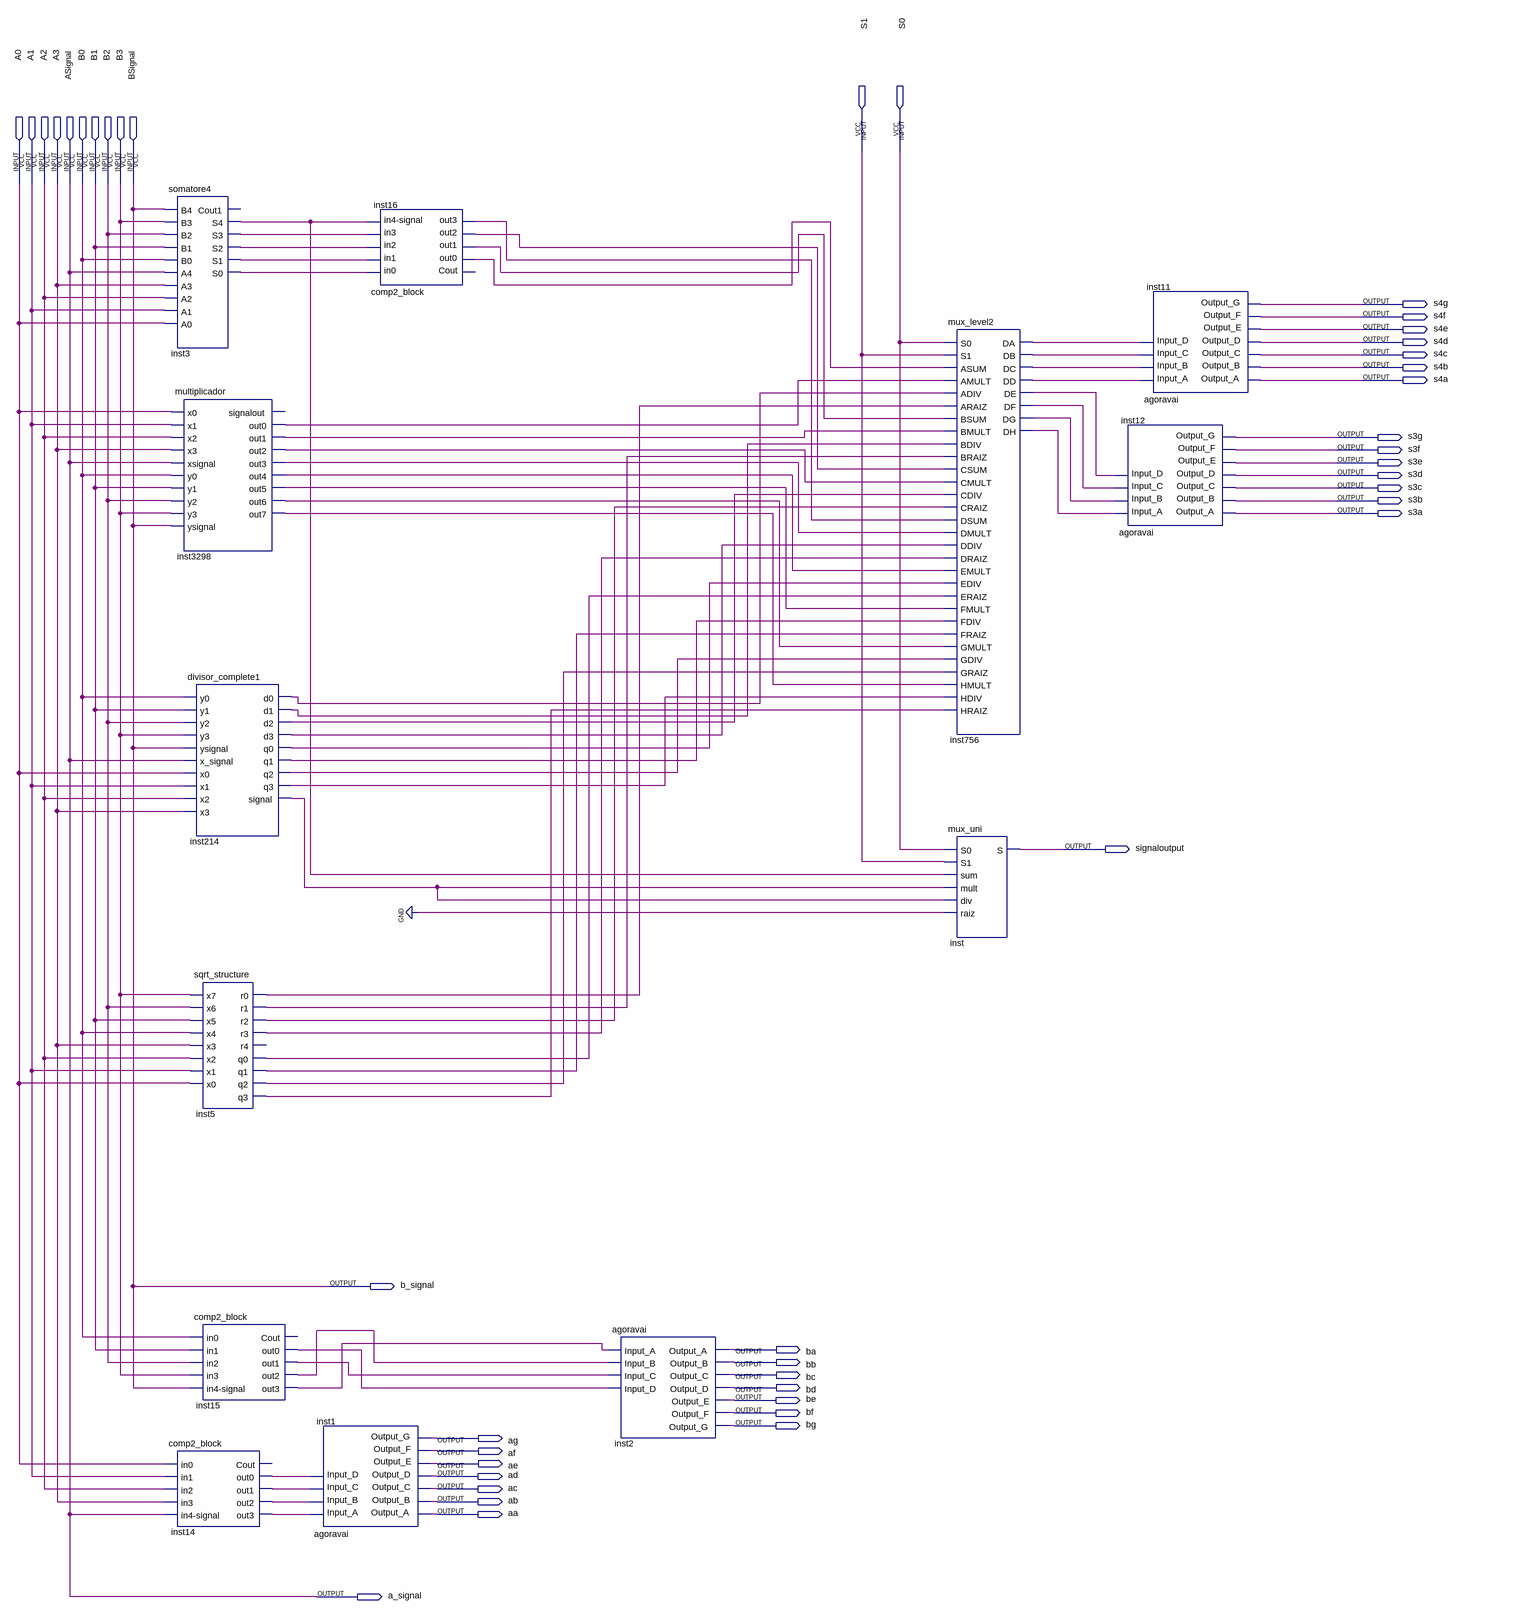
[diagram p0: schematic sheet]
// Quartus schematic end_project(2).bdf as structural Verilog: 13 symbols, 43 pins
module \end_project(2)  (
  input  S1,
  input  S0,
  input  A0,
  input  A1,
  input  A2,
  input  A3,
  input  ASignal,
  input  B0,
  input  B1,
  input  B2,
  input  B3,
  input  BSignal,
  output s4g,
  output s4f,
  output s4e,
  output s4d,
  output s4c,
  output s4b,
  output s4a,
  output s3g,
  output s3f,
  output s3e,
  output s3d,
  output s3c,
  output s3b,
  output s3a,
  output signaloutput,
  output b_signal,
  output ba,
  output bb,
  output bc,
  output bd,
  output be,
  output bf,
  output bg,
  output ag,
  output af,
  output ae,
  output ad,
  output ac,
  output ab,
  output aa,
  output a_signal
);

  wire inst3_s0, inst3_s1, inst3_s2, inst3_s3, inst3_s4, inst5_q0, inst5_q1, inst5_q2, inst5_q3, inst5_r0,
       inst5_r1, inst5_r2, inst5_r3, inst14_out0, inst14_out1, inst14_out2, inst14_out3, inst15_out0,
       inst15_out1, inst15_out2, inst15_out3, inst16_out0, inst16_out1, inst16_out2, inst16_out3, inst214_d0,
       inst214_d1, inst214_d2, inst214_d3, inst214_q0, inst214_q1, inst214_q2, inst214_q3, inst214_signal,
       inst756_da, inst756_db, inst756_dc, inst756_dd, inst756_de, inst756_df, inst756_dg, inst756_dh,
       inst3298_out0, inst3298_out1, inst3298_out2, inst3298_out3, inst3298_out4, inst3298_out5,
       inst3298_out6, inst3298_out7;

  somatore4 inst3 (
    .B4(BSignal), .B3(B3), .B2(B2), .B1(B1), .B0(B0), .A4(ASignal), .A3(A3), .A2(A2), .A1(A1), .A0(A0),
    .S4(inst3_s4), .S3(inst3_s3), .S2(inst3_s2), .S1(inst3_s1), .S0(inst3_s0));  // open: Cout1
  multiplicador inst3298 (
    .x0(A0), .x1(A1), .x2(A2), .x3(A3), .xsignal(ASignal), .y0(B0), .y1(B1), .y2(B2), .y3(B3),
    .ysignal(BSignal), .out0(inst3298_out0), .out1(inst3298_out1), .out2(inst3298_out2),
    .out3(inst3298_out3), .out4(inst3298_out4), .out5(inst3298_out5), .out6(inst3298_out6),
    .out7(inst3298_out7));  // open: signalout
  divisor_complete1 inst214 (
    .y0(B0), .y1(B1), .y2(B2), .y3(B3), .ysignal(BSignal), .x_signal(ASignal), .x0(A0), .x1(A1), .x2(A2),
    .x3(A3), .d0(inst214_d0), .d1(inst214_d1), .d2(inst214_d2), .d3(inst214_d3), .q0(inst214_q0),
    .q1(inst214_q1), .q2(inst214_q2), .q3(inst214_q3), .signal(inst214_signal));
  sqrt_structure inst5 (
    .x7(B3), .x6(B2), .x5(B1), .x4(B0), .x3(A3), .x2(A2), .x1(A1), .x0(A0), .r0(inst5_r0), .r1(inst5_r1),
    .r2(inst5_r2), .r3(inst5_r3), .q0(inst5_q0), .q1(inst5_q1), .q2(inst5_q2), .q3(inst5_q3));  // open: r4
  comp2_block inst15 (
    .in0(B0), .in1(B1), .in2(B2), .in3(B3), .\in4-signal (BSignal), .out0(inst15_out0), .out1(inst15_out1),
    .out2(inst15_out2), .out3(inst15_out3));  // open: Cout
  comp2_block inst14 (
    .in0(A0), .in1(A1), .in2(A2), .in3(A3), .\in4-signal (ASignal), .out0(inst14_out0), .out1(inst14_out1),
    .out2(inst14_out2), .out3(inst14_out3));  // open: Cout
  agoravai inst1 (
    .Input_A(inst14_out3), .Input_B(inst14_out2), .Input_C(inst14_out1), .Input_D(inst14_out0),
    .Output_A(aa), .Output_B(ab), .Output_C(ac), .Output_D(ad), .Output_E(ae), .Output_F(af), .Output_G(ag));
  comp2_block inst16 (
    .in0(inst3_s0), .in1(inst3_s1), .in2(inst3_s2), .in3(inst3_s3), .\in4-signal (inst3_s4),
    .out0(inst16_out0), .out1(inst16_out1), .out2(inst16_out2), .out3(inst16_out3));  // open: Cout
  agoravai inst2 (
    .Input_A(inst15_out3), .Input_B(inst15_out2), .Input_C(inst15_out1), .Input_D(inst15_out0),
    .Output_A(ba), .Output_B(bb), .Output_C(bc), .Output_D(bd), .Output_E(be), .Output_F(bf), .Output_G(bg));
  mux_level2 inst756 (
    .S0(S0), .S1(S1), .ASUM(inst16_out0), .AMULT(inst3298_out0), .ADIV(inst214_d0), .ARAIZ(inst5_r0),
    .BSUM(inst16_out1), .BMULT(inst3298_out1), .BDIV(inst214_d1), .BRAIZ(inst5_r1), .CSUM(inst16_out2),
    .CMULT(inst3298_out2), .CDIV(inst214_d2), .CRAIZ(inst5_r2), .DSUM(inst16_out3), .DMULT(inst3298_out3),
    .DDIV(inst214_d3), .DRAIZ(inst5_r3), .EMULT(inst3298_out4), .EDIV(inst214_q0), .ERAIZ(inst5_q0),
    .FMULT(inst3298_out5), .FDIV(inst214_q1), .FRAIZ(inst5_q1), .GMULT(inst3298_out6), .GDIV(inst214_q2),
    .GRAIZ(inst5_q2), .HMULT(inst3298_out7), .HDIV(inst214_q3), .HRAIZ(inst5_q3), .DA(inst756_da),
    .DB(inst756_db), .DC(inst756_dc), .DD(inst756_dd), .DE(inst756_de), .DF(inst756_df), .DG(inst756_dg),
    .DH(inst756_dh));
  mux_uni inst (
    .S0(S0), .S1(S1), .sum(inst3_s4), .mult(inst214_signal), .div(inst214_signal), .raiz(1'b0),
    .S(signaloutput));
  agoravai inst12 (
    .Input_A(inst756_dh), .Input_B(inst756_dg), .Input_C(inst756_df), .Input_D(inst756_de), .Output_A(s3a),
    .Output_B(s3b), .Output_C(s3c), .Output_D(s3d), .Output_E(s3e), .Output_F(s3f), .Output_G(s3g));
  agoravai inst11 (
    .Input_A(inst756_dd), .Input_B(inst756_dc), .Input_C(inst756_db), .Input_D(inst756_da), .Output_A(s4a),
    .Output_B(s4b), .Output_C(s4c), .Output_D(s4d), .Output_E(s4e), .Output_F(s4f), .Output_G(s4g));

  assign a_signal = ASignal;
  assign b_signal = BSignal;
endmodule
